# Altium schematic sheet TMS320F28379D.SchDoc
size Letter
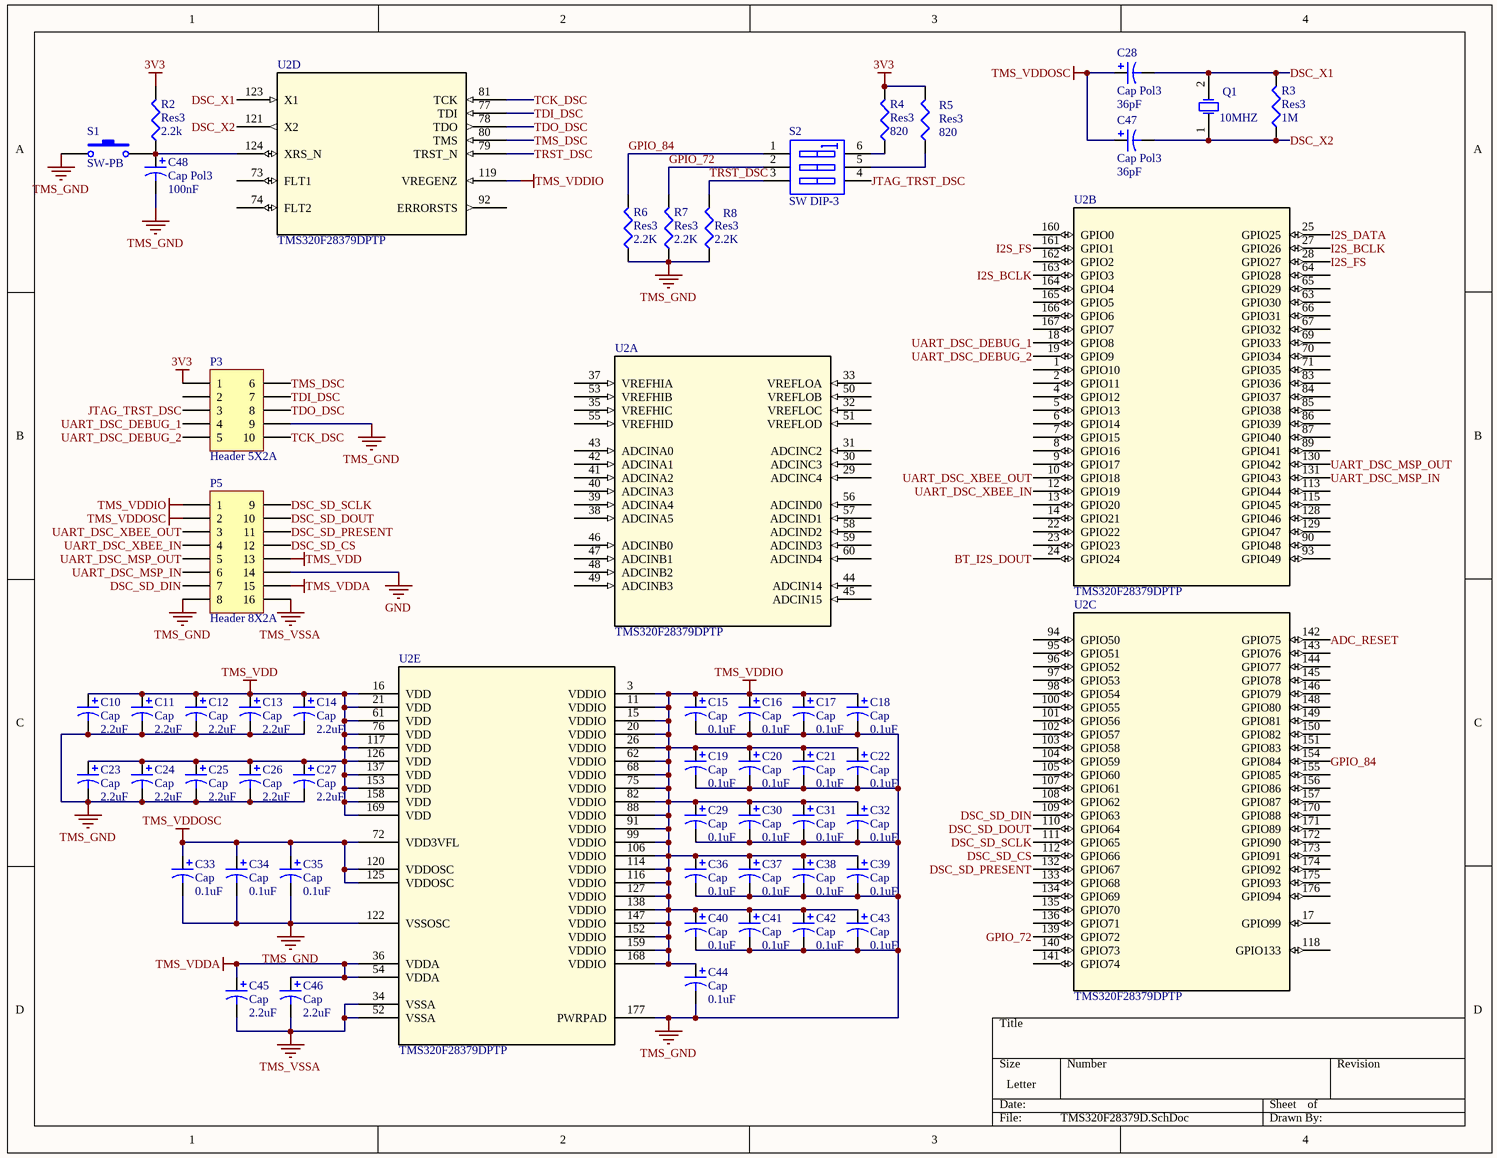
[diagram p0: TMS320F28379D.SchDoc]

## Parts
C10  Cap  value 2.2uF  [C0805]
C11  Cap  value 2.2uF  [C0805]
C12  Cap  value 2.2uF  [C0805]
C13  Cap  value 2.2uF  [C0805]
C14  Cap  value 2.2uF  [C0805]
C15  Cap  value 0.1uF  [C0805]
C16  Cap  value 0.1uF  [C0805]
C17  Cap  value 0.1uF  [C0805]
C18  Cap  value 0.1uF  [C0805]
C19  Cap  value 0.1uF  [C0805]
C20  Cap  value 0.1uF  [C0805]
C21  Cap  value 0.1uF  [C0805]
C22  Cap  value 0.1uF  [C0805]
C23  Cap  value 2.2uF  [C0805]
C24  Cap  value 2.2uF  [C0805]
C25  Cap  value 2.2uF  [C0805]
C26  Cap  value 2.2uF  [C0805]
C27  Cap  value 2.2uF  [C0805]
C28  Cap Pol3  value 36pF  [C0805]
C29  Cap  value 0.1uF  [C0805]
C30  Cap  value 0.1uF  [C0805]
C31  Cap  value 0.1uF  [C0805]
C32  Cap  value 0.1uF  [C0805]
C33  Cap  value 0.1uF  [C0805]
C34  Cap  value 0.1uF  [C0805]
C35  Cap  value 0.1uF  [C0805]
C36  Cap  value 0.1uF  [C0805]
C37  Cap  value 0.1uF  [C0805]
C38  Cap  value 0.1uF  [C0805]
C39  Cap  value 0.1uF  [C0805]
C40  Cap  value 0.1uF  [C0805]
C41  Cap  value 0.1uF  [C0805]
C42  Cap  value 0.1uF  [C0805]
C43  Cap  value 0.1uF  [C0805]
C44  Cap  value 0.1uF  [C0805]
C45  Cap  value 2.2uF  [C0805]
C46  Cap  value 2.2uF  [C0805]
C47  Cap Pol3  value 36pF  [C0805]
C48  Cap Pol3  value 100nF  [C0805]
P3  Header 5X2A  [HDR2X5_CEN]
P5  Header 8X2A  [HDR2X8_CEN]
Q1  10MHZ  [HC-49U]
R2  Res3  value 2.2k  [14-1210]
R3  Res3  value 1M  [14-1210]
R4  Res3  value 820  [14-1210]
R5  Res3  value 820  [14-1210]
R6  Res3  value 2.2K  [14-1210]
R7  Res3  value 2.2K  [14-1210]
R8  Res3  value 2.2K  [14-1210]
S1  SW-PB  [SW PB]
S2  SW DIP-3  [DIP-6]
U2  TMS320F28379DPTP  [PTP0176F_N]  (parts A,B,C,D,E of 5)

## Nets
3V3: P3.1 R2.2 R4.2 R5.2
GND: P5.14
TMS_GND: C10.2 C11.2 C12.2 C13.2 C14.2 C15.2 C16.2 C17.2 C18.2 C19.2 C20.2 C21.2 C22.2 C23.2 C24.2 C25.2 C26.2 C27.2 C29.2 C30.2 C31.2 C32.2 C33.2 C34.2 C35.2 C36.2 C37.2 C38.2 C39.2 C40.2 C41.2 C42.2 C43.2 C44.2 C48.2 P3.9 P5.8 R6.1 R7.1 R8.1 S1.1 U2.122(VSSOSC) U2.177(PWRPAD)
TMS_VDD: C10.1 C11.1 C12.1 C13.1 C14.1 C23.1 C24.1 C25.1 C26.1 C27.1 P5.13 U2.16(VDD) U2.21(VDD) U2.61(VDD) U2.76(VDD) U2.117(VDD) U2.126(VDD) U2.137(VDD) U2.153(VDD) U2.158(VDD) U2.169(VDD)
TMS_VDDA: C45.1 C46.1 P5.15 U2.36(VDDA) U2.54(VDDA)
TMS_VDDIO: C15.1 C16.1 C17.1 C18.1 C19.1 C20.1 C21.1 C22.1 C29.1 C30.1 C31.1 C32.1 C36.1 C37.1 C38.1 C39.1 C40.1 C41.1 C42.1 C43.1 C44.1 P5.1 U2.3(VDDIO) U2.11(VDDIO) U2.15(VDDIO) U2.20(VDDIO) U2.26(VDDIO) U2.62(VDDIO) U2.68(VDDIO) U2.75(VDDIO) U2.82(VDDIO) U2.88(VDDIO) U2.91(VDDIO) U2.99(VDDIO) U2.106(VDDIO) U2.114(VDDIO) U2.116(VDDIO) U2.119(VREGENZ) U2.127(VDDIO) U2.138(VDDIO) U2.147(VDDIO) U2.152(VDDIO) U2.159(VDDIO) U2.168(VDDIO)
TMS_VDDOSC: C28.1 C33.1 C34.1 C35.1 C47.1 P5.2 U2.72(VDD3VFL) U2.120(VDDOSC) U2.125(VDDOSC)
TMS_VSSA: C45.2 C46.2 P5.16 U2.34(VSSA) U2.52(VSSA)
ADC_RESET: U2.142(GPIO75)
BT_I2S_DOUT: U2.24(GPIO24)
DSC_SD_CS: P5.12 U2.112(GPIO66)
DSC_SD_DIN: P5.7 U2.109(GPIO63)
DSC_SD_DOUT: P5.10 U2.110(GPIO64)
DSC_SD_PRESENT: P5.11 U2.132(GPIO67)
DSC_SD_SCLK: P5.9 U2.111(GPIO65)
DSC_X1: C28.2 Q1.2(OSC2) R3.2 U2.123(X1)
DSC_X2: C47.2 Q1.1(OSC1) R3.1 U2.121(X2)
GPIO_72: R7.2 S2.2(A2) U2.139(GPIO72)
GPIO_84: R6.2 S2.1(A1) U2.154(GPIO84)
I2S_BCLK: U2.27(GPIO26) U2.163(GPIO3)
I2S_DATA: U2.25(GPIO25)
I2S_FS: U2.28(GPIO27) U2.161(GPIO1)
JTAG_TRST_DSC: P3.3 S2.4(B3)
TCK_DSC: P3.10 U2.81(TCK)
TDI_DSC: P3.7 U2.77(TDI)
TDO_DSC: P3.8 U2.78(TDO)
TMS_DSC: P3.6 U2.80(TMS)
TRST_DSC: R8.2 S2.3(A3) U2.79(TRST_N)
UART_DSC_DEBUG_1: P3.4 U2.18(GPIO8)
UART_DSC_DEBUG_2: P3.5 U2.19(GPIO9)
UART_DSC_MSP_IN: P5.6 U2.131(GPIO43)
UART_DSC_MSP_OUT: P5.5 U2.130(GPIO42)
UART_DSC_XBEE_IN: P5.4 U2.12(GPIO19)
UART_DSC_XBEE_OUT: P5.3 U2.10(GPIO18)
NetC48_1: C48.1 R2.1 S1.2 U2.124(XRS_N)
NetR4_1: R4.1 S2.6(B1)
NetR5_1: R5.1 S2.5(B2)

Not connected (* = marked no-connect by the designer): P3 2; U2 1(GPIO10) 2(GPIO11) 4(GPIO12) 5(GPIO13) 6(GPIO14) 7(GPIO15) 8(GPIO16) 9(GPIO17) 13(GPIO20) 14(GPIO21) 17(GPIO99) 22(GPIO22) 23(GPIO23) 29(ADCINC4) 30(ADCINC3) 31(ADCINC2) 32(VREFLOC) 33(VREFLOA) 35(VREFHIC) 37(VREFHIA) 38(ADCINA5) 39(ADCINA4) 40(ADCINA3) 41(ADCINA2) 42(ADCINA1) 43(ADCINA0) 44(ADCIN14) 45(ADCIN15) 46(ADCINB0) 47(ADCINB1) 48(ADCINB2) 49(ADCINB3) 50(VREFLOB) 51(VREFLOD) 53(VREFHIB) 55(VREFHID) 56(ADCIND0) 57(ADCIND1) 58(ADCIND2) 59(ADCIND3) 60(ADCIND4) 63(GPIO30) 64(GPIO28) 65(GPIO29) 66(GPIO31) 67(GPIO32) 69(GPIO33) 70(GPIO34) 71(GPIO35) 73(FLT1) 74(FLT2) 83(GPIO36) 84(GPIO37) 85(GPIO38) 86(GPIO39) 87(GPIO40) 89(GPIO41) 90(GPIO48) 92(ERRORSTS) 93(GPIO49) 94(GPIO50) 95(GPIO51) 96(GPIO52) 97(GPIO53) 98(GPIO54) 100(GPIO55) 101(GPIO56) 102(GPIO57) 103(GPIO58) 104(GPIO59) 105(GPIO60) 107(GPIO61) 108(GPIO62) 113(GPIO44) 115(GPIO45) 118(GPIO133) 128(GPIO46) 129(GPIO47) 133(GPIO68) 134(GPIO69) 135(GPIO70) 136(GPIO71) 140(GPIO73) 141(GPIO74) 143(GPIO76) 144(GPIO77) 145(GPIO78) 146(GPIO79) 148(GPIO80) 149(GPIO81) 150(GPIO82) 151(GPIO83) 155(GPIO85) 156(GPIO86) 157(GPIO87) 160(GPIO0) 162(GPIO2) 164(GPIO4) 165(GPIO5) 166(GPIO6) 167(GPIO7) 170(GPIO88) 171(GPIO89) 172(GPIO90) 173(GPIO91) 174(GPIO92) 175(GPIO93) 176(GPIO94)

## Library data of the parts
C10-C48 = Cap Pol3: Polarized Capacitor (Surface Mount); Published: 8-Jun-2000; LatestRevisionDate: 29-May-2009; LatestRevisionNote: IPC-7351 Footprint Added.; PackageReference: C0805; Publisher: Altium Limited; PackageDescription: Chip Capacitor
P3 = Header 5X2A: Header, 5-Pin, Dual row; LatestRevisionDate: 17-Jul-2002; LatestRevisionNote: Re-released for DXP Platform.; Publisher: Altium Limited
P5 = Header 8X2A: Header, 8-Pin, Dual row; LatestRevisionDate: 17-Jul-2002; LatestRevisionNote: Re-released for DXP Platform.; Publisher: Altium Limited
Q1 = ECS-10-13-1: Crystal Oscillator; Published: 17-Jul-2002; DatasheetDocument: 18-Apr-2000; PackageReference: HC-49U; Publisher: Altium Limited; ComponentLink1Description: Manufacturer Link; ComponentLink1URL: http://www.ecsxtal.com/; ComponentLink2Description: Datasheet; ComponentLink2URL: http://www.ecsxtal.com/pdf2/HC49U.PDF
R2-R8 = Res3: Resistor; Published: 8-Jun-2000; LatestRevisionDate: 29-May-2009; LatestRevisionNote: IPC-7351 Footprint Added.; PackageReference: J1-0603; Publisher: Altium Limited; PackageDescription: Chip Resistor
S1 = SW-PB_2: DIGIKEY SW400-ND; Published: 24-Mar-1999; LatestRevisionDate: 17-Jul-2002; LatestRevisionNote: Re-released for DXP Platform.; Publisher: Altium Limited
S2 = SW DIP-3: DIP Switch, 3 Position, SPST; Published: 24-Mar-1999; LatestRevisionDate: 17-Jul-2002; LatestRevisionNote: Re-released for DXP Platform.; PackageReference: DIP-6; Publisher: Altium Limited; Code_JEDEC: MO-001-AM
U2 = TMS320F28379DPTP: Imported; PartNumber: TMS320F28379DPTPS; Manufacturer: Texas Instruments; RefDes: RefDes; TYPE: TYPE; Value: Value